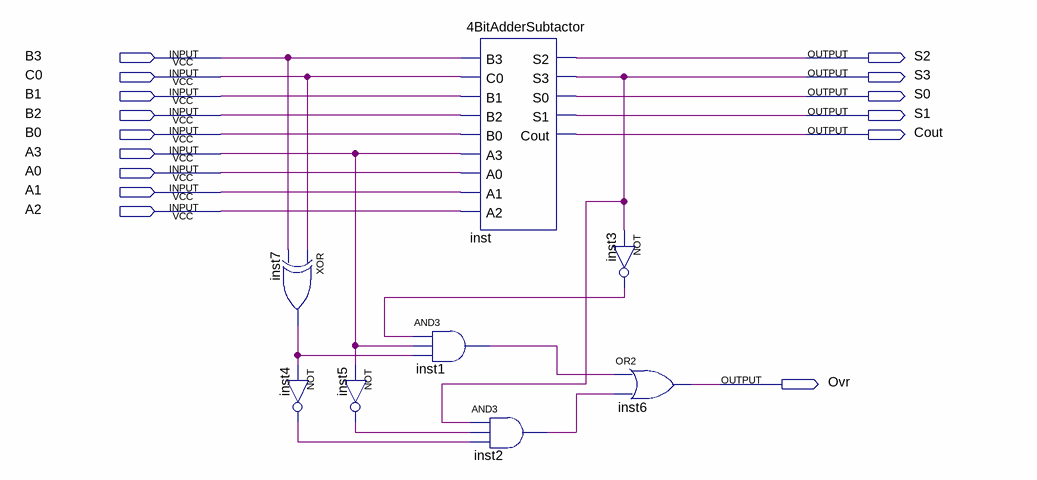
[diagram p0: schematic sheet]
// Quartus schematic AddSubOvr.bdf as structural Verilog: 8 symbols, 15 pins
module AddSubOvr (
  input  B3,
  input  C0,
  input  B1,
  input  B2,
  input  B0,
  input  A3,
  input  A0,
  input  A1,
  input  A2,
  output S2,
  output S3,
  output S0,
  output S1,
  output Cout,
  output Ovr
);

  wire inst1_out, inst2_out, inst3_out, inst4_out, inst5_out, inst7_out;

  xor inst7 (inst7_out, C0, B3);
  not inst4 (inst4_out, inst7_out);
  not inst5 (inst5_out, A3);
  and inst1 (inst1_out, inst3_out, A3, inst7_out);
  \4BitAdderSubtactor  inst (
    .B3(B3), .C0(C0), .B1(B1), .B2(B2), .B0(B0), .A3(A3), .A0(A0), .A1(A1), .A2(A2), .S2(S2), .S3(S3),
    .S0(S0), .S1(S1), .Cout(Cout));
  and inst2 (inst2_out, S3, inst5_out, inst4_out);
  not inst3 (inst3_out, S3);
  or inst6 (Ovr, inst1_out, inst2_out);
endmodule
